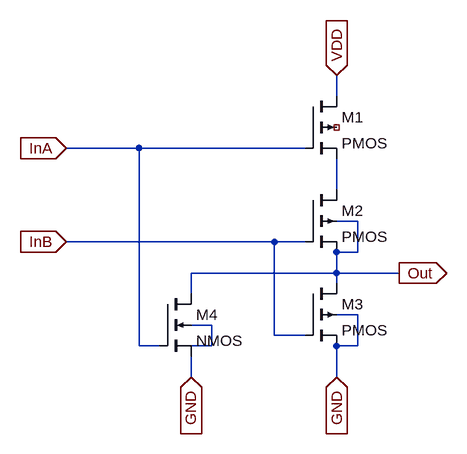
[diagram p0: schematic Draft3.asc]
Draft3.asc, the LTspice schematic file:
Version 4
SHEET 1 880 680
WIRE 224 96 224 64
WIRE -80 176 -192 176
WIRE 176 176 -80 176
WIRE 224 240 224 192
WIRE 256 288 224 288
WIRE 128 320 -192 320
WIRE 176 320 128 320
WIRE 256 336 256 288
WIRE 256 336 224 336
WIRE 224 368 224 336
WIRE 224 368 0 368
WIRE 320 368 224 368
WIRE 224 384 224 368
WIRE 0 400 0 368
WIRE 256 432 224 432
WIRE 32 448 0 448
WIRE 128 464 128 320
WIRE 176 464 128 464
WIRE -80 480 -80 176
WIRE -48 480 -80 480
WIRE 32 480 32 448
WIRE 32 480 0 480
WIRE 256 480 256 432
WIRE 256 480 224 480
WIRE 0 528 0 496
WIRE 224 528 224 480
FLAG 320 368 Out
IOPIN 320 368 Out
FLAG -192 176 InA
IOPIN -192 176 In
FLAG -192 320 InB
IOPIN -192 320 In
FLAG 224 64 VDD
IOPIN 224 64 In
FLAG 224 528 GND
IOPIN 224 528 In
FLAG 0 528 GND
IOPIN 0 528 In
SYMBOL pmos4 176 96 R0
SYMATTR InstName M1
SYMBOL pmos4 176 240 R0
SYMATTR InstName M2
SYMBOL pmos4 176 384 R0
SYMATTR InstName M3
SYMBOL nmos4 -48 400 R0
SYMATTR InstName M4

The netlist it stands for:
* Draft3.asc
M1 VDD InA N001 NC_01 PMOS
M2 N001 InB Out Out PMOS
M3 Out InB GND GND PMOS
M4 Out InA GND N002 NMOS
.model NMOS NMOS
.model PMOS PMOS
.lib standard.mos
.backanno
.end